# EAGLE design nh-4.3-breakout-v0001 (EAGLE 6.4)

## Sheet 1 of 2
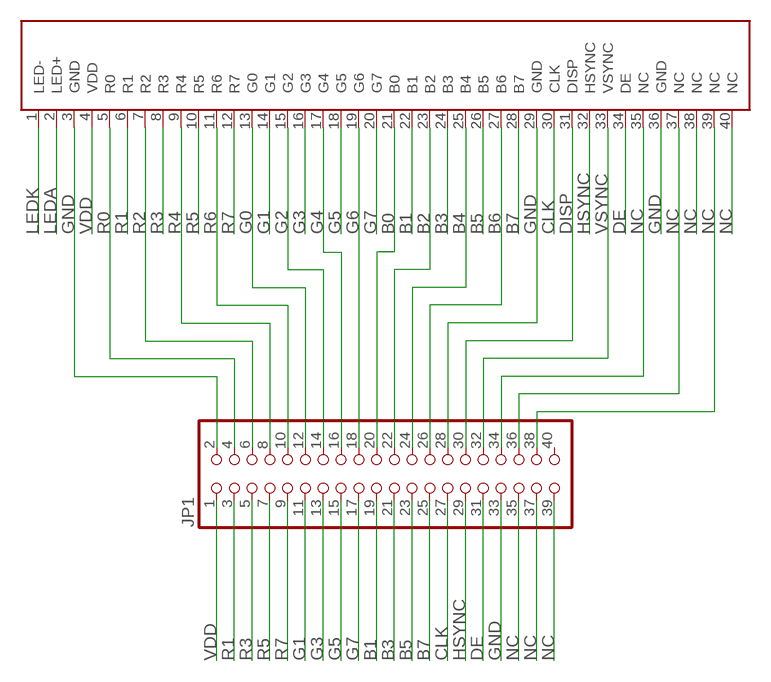
[diagram p0: schematic, sheet 1]

### Parts
JP1  PINHD-2X20  [2X20]
U$1  NH-4.3  [FPC-40]

### Nets
B0: JP1.20 U$1.21(B0)
B1: JP1.19 U$1.22(B1)
B2: JP1.22 U$1.23(B2)
B3: JP1.21 U$1.24(B3)
B4: JP1.24 U$1.25(B4)
B5: JP1.23 U$1.26(B5)
B6: JP1.26 U$1.27(B6)
B7: JP1.25 U$1.28(B7)
CLK: JP1.27 U$1.30(CLK)
DE: JP1.31 U$1.34(DE)
DISP: JP1.30 U$1.31(DISP)
G0: JP1.12 U$1.13(G0)
G1: JP1.11 U$1.14(G1)
G2: JP1.14 U$1.15(G2)
G3: JP1.13 U$1.16(G3)
G4: JP1.16 U$1.17(G4)
G5: JP1.15 U$1.18(G5)
G6: JP1.18 U$1.19(G6)
G7: JP1.17 U$1.20(G7)
GND: JP1.2 JP1.28 JP1.33 U$1.3(GND) U$1.29(GND) U$1.36(GND) ; also sheet 2
HSYNC: JP1.29 U$1.32(HSYNC)
LEDA: U$1.2(LED+) ; also sheet 2
LEDK: U$1.1(LED-) ; also sheet 2
NC: JP1.34 JP1.35 JP1.36 JP1.37 JP1.38 JP1.39 U$1.35(NC) U$1.37(NC) U$1.38(NC) U$1.39(NC) U$1.40(NC)
R0: JP1.4 U$1.5(R0)
R1: JP1.3 U$1.6(R1)
R2: JP1.6 U$1.7(R2)
R3: JP1.5 U$1.8(R3)
R4: JP1.8 U$1.9(R4)
R5: JP1.7 U$1.10(R5)
R6: JP1.10 U$1.11(R6)
R7: JP1.9 U$1.12(R7)
VDD: JP1.1 U$1.4(VDD)
VSYNC: JP1.32 U$1.33(VSYNC)
Unconnected: JP1.40

## Sheet 2 of 2
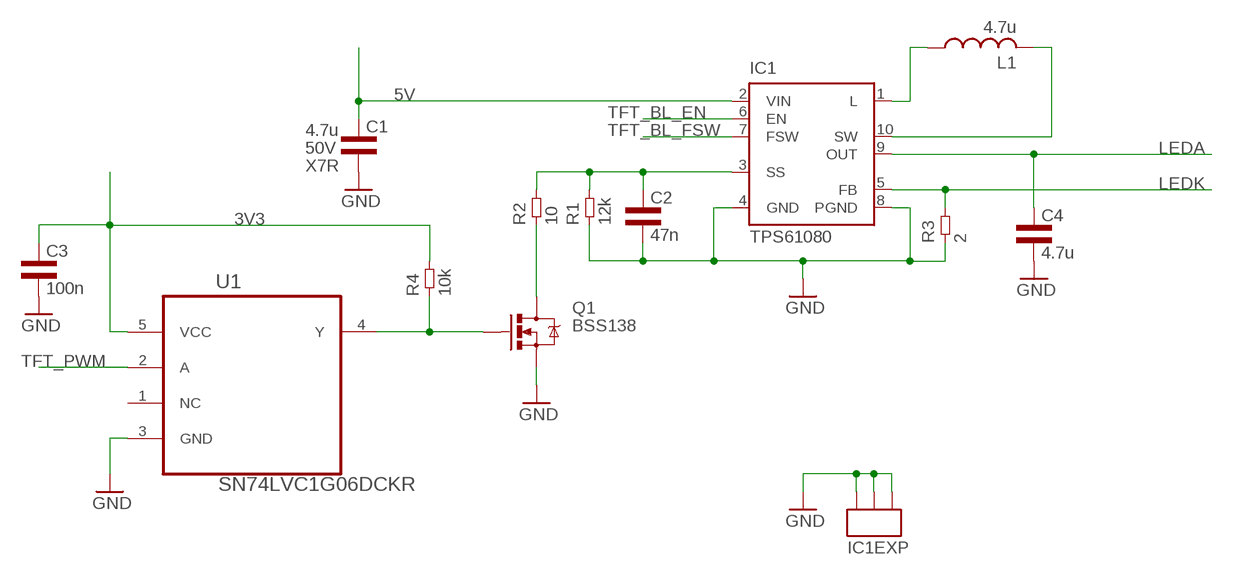
[diagram p1: schematic, sheet 2]

### Parts
C1  4.7u  CAP1210L3  [1210L3]
C2  47n  CAP0603L3  [0603L3]
C3  100n  CAP0603L3  [0603L3]
C4  4.7u  CAP1210L3  [1210L3]
IC1  TPS61080  [S-PDSO-N10]
L1  4.7u  RCL_L-US  [RCL_VLCF4018-2]
Q1  MOSFET-NCHANNELBSS138  [SOT23]
R1  12k  RES0603L3  [0603L3]
R2  10  RES0603L3  [0603L3]
R3  2  RES1210L3  [1210L3]
R4  10k  RES0603L3  [0603L3]
U1  SN74LVC1G06DCKR  [SOT65P210X110-5N]

### Nets
3V3: C3.P$1 R4.P$2 U1.5(VCC)
5V: C1.P$1 IC1.2(VIN)
GND: C1.P$2 C2.P$2 C3.P$2 C4.P$2 IC1.4(GND) IC1.8(PGND) IC1.PP(EXP) IC1.PP@1(EXP) IC1.PP@2(EXP) Q1.2(S) R1.P$1 R3.P$1 U1.3(GND) ; also sheet 1
LEDA: C4.P$1 IC1.9(OUT) ; also sheet 1
LEDK: IC1.5(FB) R3.P$2 ; also sheet 1
N$2: C2.P$1 IC1.3(SS) R1.P$2 R2.P$2
N$3: Q1.3(D) R2.P$1
N$10: IC1.10(SW) L1.2
N$11: IC1.1(L) L1.1
TFT_BL_EN: IC1.6(EN)
TFT_BL_FSW: IC1.7(FSW)
TFT_PWM: U1.2(A)
Y: Q1.1(G) R4.P$1 U1.4(Y)
Unconnected: U1.1(NC)

### Notes on the sheet
- BSS138

## Library data of the parts
C1 = common:CAP; DIELECTRIC: X7R; VOLTAGE: 50V
C2-C4 = common:CAP
IC1 = texas:TPS6108*: HIGH VOLTAGE DC/DC BOOST CONVERTER WITH 0.5-A/1.3-A INTEGRATED SWITCH Source: www.ti.com .. tps61081[1].pdf; MPN: TPS61080DRCT; OC_FARNELL: 1412517; OC_NEWARK: 30M1831
JP1 = adafruit:PINHD-2X20: PIN HEADER
L1 = nhd-4_3-adapter:RCL_L-US: INDUCTOR, American symbol
Q1 = SparkFun-DiscreteSemi:MOSFET-NCHANNEL: Common NMOSFET Parts MFG P/N Store ID Prod ID FDD8780 TRANS-09984 SI7820DN TRANS-11055 FDS6630A IC-08089 2N7002PW TRANS-11151 FQP30N06L COM-10213 TRANS-10060 BSS123LT1G TRANS-08345 BSS138 TRANS-00830 BS170 2N7000; PROD_ID: TRANS-00830
R1-R4 = common:RES
U1 = Texas Instruments_By_element14_Batch_1:SN74LVC1G06DCKR: SINGLE INVERTER BUFFER/DRIVER WITH OPEN-DRAIN OUTPUT; MPN: SN74LVC1G06DCKR; OC_FARNELL: 1871697; OC_NEWARK: 76C4074; PACKAGE: SC70-5; SUPPLIER: Texas Instruments
U$1 = common:NH-4.3

## Board
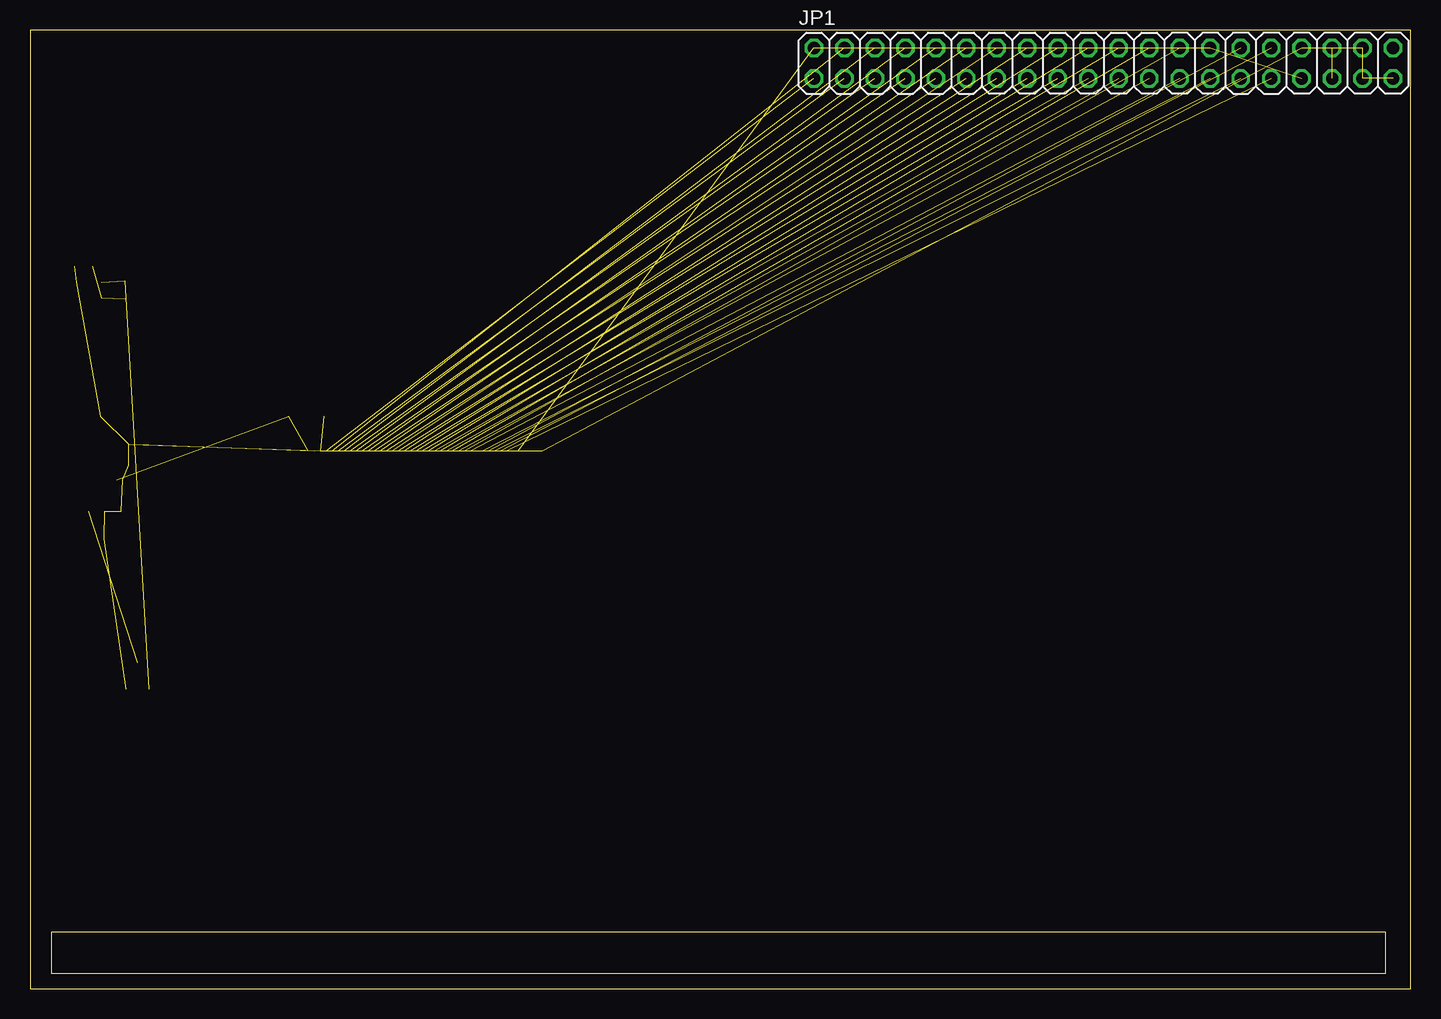
[diagram p2: board, top side]
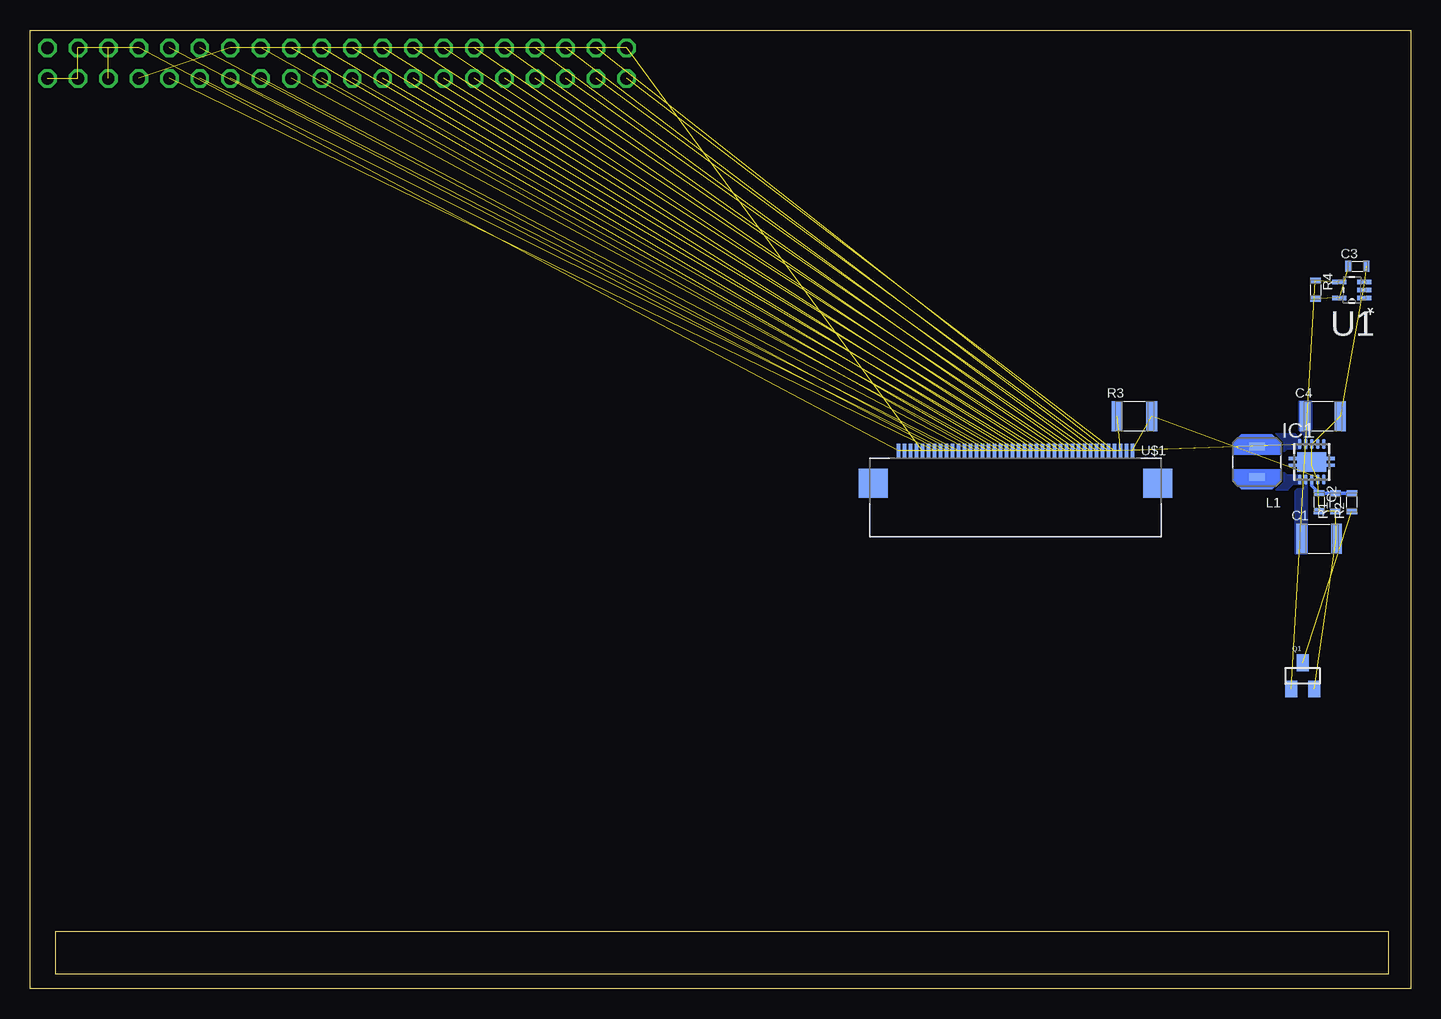
[diagram p3: board, bottom side, seen from below]

Size 115.04 x 79.88 mm. Coordinates in mm from the lower left corner, seen from the top.
Outline: 0,0 115.04,0 115.04,79.88 0,79.88 0,0
Outline: 1.83,1.22 1.83,4.72 112.93,4.72 112.93,1.22 1.83,1.22
Copper layers (1*16): Top 0.035mm / dielectric 1.5mm / Bottom 0.035mm
Design rules "default": minimum track width 10mil, minimum drill 24mil, track to track 8mil, track to pad 8mil, pad to pad 8mil, via to via 8mil, smd to smd 8mil, copper to edge 40mil, drill to drill 8mil, minimum pad ring 10mil, minimum via ring 8mil, stop-mask expansion 4mil, vias tented up to drill 0mil, thermal gap 10mil

### Footprints (pad centres in the part's own frame; a part is rotated, then mirrored left to right if it is on the bottom)
1210L3 = smd 0.9 x 2.5: P$1 -1.45,0; P$2 1.45,0
0603L3 = smd 0.5 x 0.9: P$1 -0.75,0; P$2 0.75,0
S-PDSO-N10 = smd 0.28 x 0.85: 1 -1,-1.475; 2 -0.5,-1.475; 3 0,-1.475; 4 0.5,-1.475; 5 1,-1.475; 6 1,1.475; 7 0.5,1.475; 8 0,1.475; 9 -0.5,1.475; 10 -1,1.475 | smd 2.4 x 1.65: PP 0,0 | smd 3.8 x 0.28: PP@1 0,0.275; PP@2 0,-0.275
2X20 = drill 1.016 octagon: 1 -24.13,-1.27; 2 -24.13,1.27; 3 -21.59,-1.27; 4 -21.59,1.27; 5 -19.05,-1.27; 6 -19.05,1.27; 7 -16.51,-1.27; 8 -16.51,1.27; 9 -13.97,-1.27; 10 -13.97,1.27; 11 -11.43,-1.27; 12 -11.43,1.27; 13 -8.89,-1.27; 14 -8.89,1.27; 15 -6.35,-1.27; 16 -6.35,1.27; 17 -3.81,-1.27; 18 -3.81,1.27; 19 -1.27,-1.27; 20 -1.27,1.27; 21 1.27,-1.27; 22 1.27,1.27; 23 3.81,-1.27; 24 3.81,1.27; 25 6.35,-1.27; 26 6.35,1.27; 27 8.89,-1.27; 28 8.89,1.27; 29 11.43,-1.27; 30 11.43,1.27; 31 13.97,-1.27; 32 13.97,1.27; 33 16.51,-1.27; 34 16.51,1.27; 35 19.05,-1.27; 36 19.05,1.27; 37 21.59,-1.27; 38 21.59,1.27; 39 24.13,-1.27; 40 24.13,1.27
RCL_VLCF4018-2 = smd 1.27 x 0.635: 1 0,1.27; 2 0,-1.27
SOT23 = smd 1 x 1.4: 1 -0.95,-1.1; 2 0.95,-1.1; 3 0,1.1
SOT65P210X110-5N = smd 1.168 x 0.356: 1 -1.041,0.66; 2 -1.041,0; 3 -1.041,-0.66; 4 1.041,-0.66; 5 1.041,0.66
FPC-40 = smd 0.3 x 1.2: 1 9.75,0; 2 9.25,0; 3 8.75,0; 4 8.25,0; 5 7.75,0; 6 7.25,0; 7 6.75,0; 8 6.25,0; 9 5.75,0; 10 5.25,0; 11 4.75,0; 12 4.25,0; 13 3.75,0; 14 3.25,0; 15 2.75,0; 16 2.25,0; 17 1.75,0; 18 1.25,0; 19 0.75,0; 20 0.25,0; 21 -0.25,0; 22 -0.75,0; 23 -1.25,0; 24 -1.75,0; 25 -2.25,0; 26 -2.75,0; 27 -3.25,0; 28 -3.75,0; 29 -4.25,0; 30 -4.75,0; 31 -5.25,0; 32 -5.75,0; 33 -6.25,0; 34 -6.75,0; 35 -7.25,0; 36 -7.75,0; 37 -8.25,0; 38 -8.75,0; 39 -9.25,0; 40 -9.75,0 | smd 2.4 x 2.4: NAIL@1 -11.85,-2.7; NAIL@2 11.85,-2.7

### Placement (x,y rotation side)
C1  7.62,37.49 0 bottom
C2  7.62,40.54 270 bottom
C3  4.42,60.2 0 bottom
C4  7.32,47.7 0 bottom
IC1  8.23,43.89 0 bottom
JP1  89.46,77.11 0 top
L1  12.8,43.89 180 bottom
Q1  8.99,26.06 0 bottom
R1  6.25,40.54 90 bottom
R2  4.88,40.54 90 bottom
R3  23.01,47.7 0 bottom
R4  7.92,58.22 270 bottom
U1  4.88,58.22 180 bottom
U$1  32.92,44.81 0 bottom

### Tracks (layer width: path | path; a pad name or v marks a point on that pad's centre or on a via)
3V3  (2 unrouted)
5V
  pour Bottom (no thermals): 8.76,42.75 8.76,41.83 8.99,41.61 9.45,41.61 9.6,41.45 9.6,36.27 8.69,36.27 8.61,36.27 8.61,42.75
B0  (1 unrouted)
B1  (1 unrouted)
B2  (1 unrouted)
B3  (1 unrouted)
B4  (1 unrouted)
B5  (1 unrouted)
B6  (1 unrouted)
B7  (1 unrouted)
CLK  (1 unrouted)
DE  (1 unrouted)
DISP  (1 unrouted)
G0  (1 unrouted)
G1  (1 unrouted)
G2  (1 unrouted)
G3  (1 unrouted)
G4  (1 unrouted)
G5  (1 unrouted)
G6  (1 unrouted)
G7  (1 unrouted)
GND  (18 unrouted)
HSYNC  (1 unrouted)
LEDA  (1 unrouted)
  pour Bottom (no thermals): 8.61,45.03 8.61,46.1 8.23,46.48 8.23,48.92 9.3,48.92 9.3,46.56 8.84,46.1 8.84,45.03
LEDK  (2 unrouted)
N$2
  Bottom 0.305: IC1.3 8.23,41.9 C2.P$1 R1.P$2 R2.P$2
N$3  (1 unrouted)
N$10
  pour Bottom (no thermals): 9.14,45.72 9.6,46.18 14.02,46.18 14.78,45.42 14.78,44.5 10.82,44.5 10.29,45.03 9.14,45.03
N$11
  pour Bottom (no thermals): 9.14,42.75 10.29,42.75 10.82,43.28 14.78,43.28 14.78,42.21 14.17,41.61 10.21,41.61 9.75,42.06 9.14,42.06
NC  (10 unrouted)
R0  (1 unrouted)
R1  (1 unrouted)
R2  (1 unrouted)
R3  (1 unrouted)
R4  (1 unrouted)
R5  (1 unrouted)
R6  (1 unrouted)
R7  (1 unrouted)
VDD  (1 unrouted)
VSYNC  (1 unrouted)
Y  (2 unrouted)